# Altium schematic sheet MAZ000176 - Diagrama físico.SchDoc: MAZ000176 - Diagrama físico
size A; ApprovedBy: Christian Ledwidth; CheckedBy: Nahuel Martinez; Author: Santiago Marti; CompanyName: Body Health; DrawnBy: Santiago Marti; Revision: A; SheetNumber: 2; SheetTotal: 2
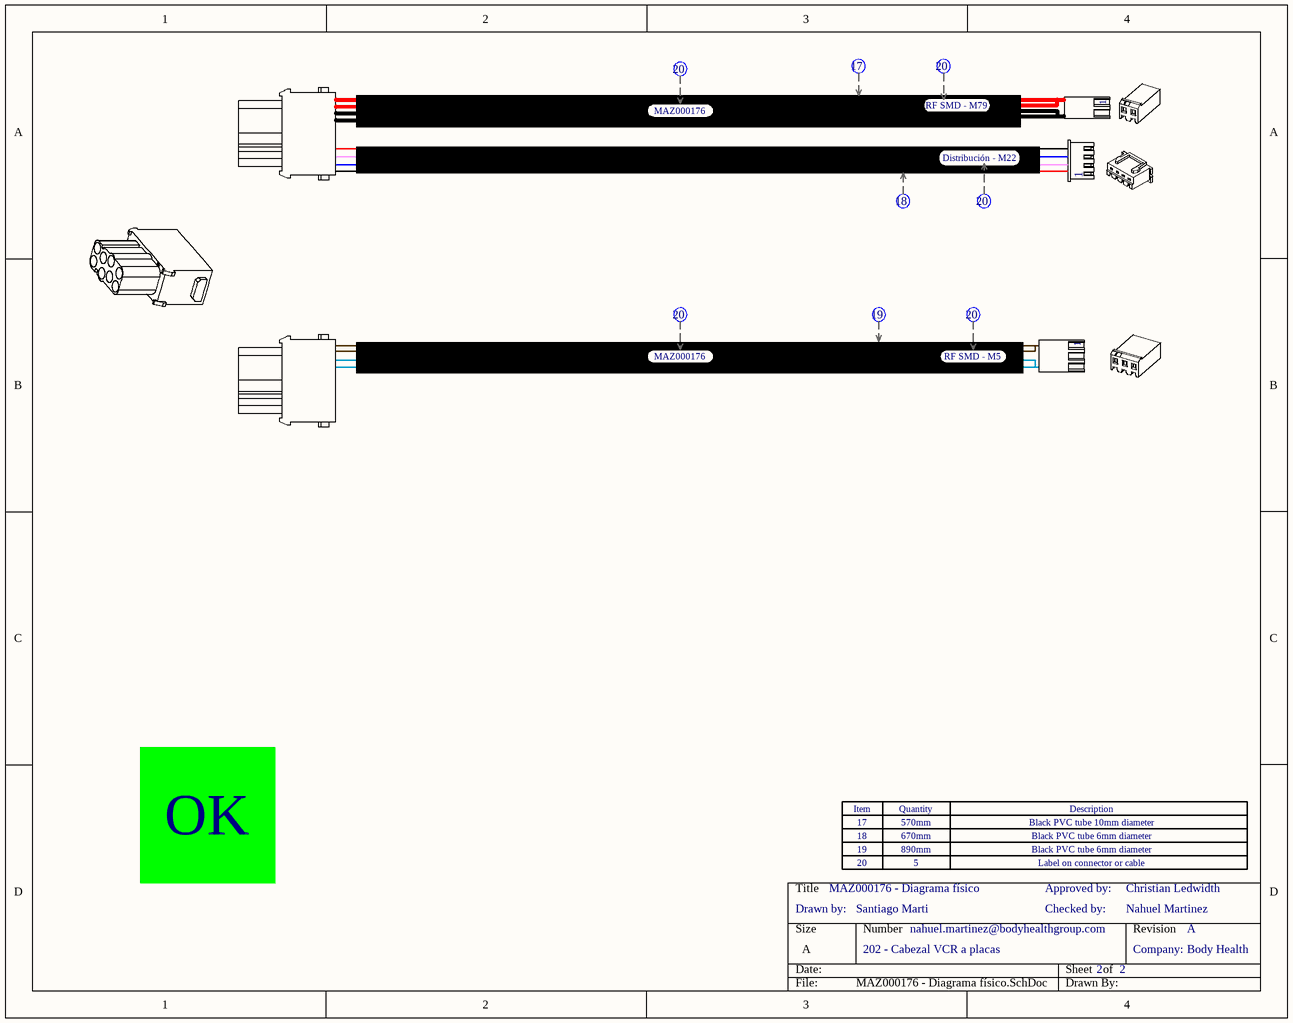
[diagram p0: MAZ000176 - Diagrama físico.SchDoc]

## Parts
(Parts that share a designator on the sheet are numbered #1, #2 ... from top to bottom, then left to right.)
Cab1  Cable  (value not drawn)
Cab2  Cable  (value not drawn)
Cab7  Cable  (value not drawn)
Cab8  Cable  (value not drawn)
Cab?#1  Cable  (value not drawn)
Cab?#2  Cable  (value not drawn)
Cab?#3  Cable  (value not drawn)
Cab?#4  Cable  (value not drawn)
Con1  XHP-4  (value not drawn)  (parts A,B of 4)
Con3  09140083101  (value not drawn)  (parts A,B of 4)
Con4  SL156-2  (value not drawn)  (parts A,B of 4)
Con6  09140083101  (value not drawn)  (part A of 4)
Con?#1  SL156-3  (value not drawn)  (part A of 4)
Con?#2  SL156-3  (value not drawn)  (part B of 4)
Zoc1  Zócalo_Header  (value not drawn)
Zoc?#1  Zócalo_Item  (value not drawn)
Zoc?#2  Zócalo_Item  (value not drawn)
Zoc?#3  Zócalo_Item  (value not drawn)
Zoc?#4  Zócalo_Item  (value not drawn)

## Notes on the sheet
- (near Cab?#3) RF SMD - M79
- (near Cab?#1) MAZ000176
- Distribución - M22
- (near Cab?#4) MAZ000176
- RF SMD - M5
- OK
- 17
- (near Zoc?#1) 18
- 570mm
- 670mm
- Black PVC tube 10mm diameter
- Black PVC tube 6mm diameter
- (near Zoc?#4) Drawn by:
- (near Zoc?#2) 19
- (near Zoc?#3) 20
- 890mm
- 5
- Checked by:
- Approved by:
- Label on connector or cable
- 202 - Cabezal VCR a placas
- nahuel.martinez@bodyhealthgroup.com
- Company:
- (in symbol Zócalo_Header) Item; Quantity; Description

## Library data of the parts
Cab1 = Cable: CallOut: 18; Largo: *mm; Sección: *mm2; Color: *
Cab2 Cab8 Cab?#1 Cab?#3 Cab?#4 = Cable: CallOut: 20; Largo: *mm; Sección: *mm2; Color: *
Cab7 = Cable: CallOut: 19; Largo: *mm; Sección: *mm2; Color: *
Cab?#2 = Cable: CallOut: 17; Largo: *mm; Sección: *mm2; Color: *
Con1 = XHP-4: CONN HOUSING 2.5MM 4POS; Fabricante: JST Sales America Inc.; Cod.DigiKey: 455-2267-ND; Cod.Fabricante: XHP-4; ComponentLink1Description: Manufacturer Link; ComponentLink1URL: http://www.jst-mfg.com/product/pdf/eng/eXH.pdf; DIGIKEYx50: 0.06220; CallOut: *; DIGIKEYx100: NO
Con3 Con6 = 09140083101: Han E Female 8 way; Fabricante: HARTING; Cod.DigiKey: 1195-1527-ND; Cod.Fabricante: 09140083101; ComponentLink1Description: Manufacturer Link; ComponentLink1URL: https://b2b.harting.com/files/download/PRD/PDF_TS/09140083101_100121409DRW009A.pdf; DIGIKEYx50: 7.60000; CallOut: *; DIGIKEYx100: 7.40000
Con4 = SL156-2: CONN RECEPT 2 POS W/RAMP SL-156; Cod.Fabricante: 640250-2; Fabricante: TE Connectivity AMP Connectors; Cod.DigiKey: A19950-ND; ComponentLink1Description: Manufacturer Link; ComponentLink1URL: https://www.te.com/commerce/DocumentDelivery/DDEController?Action=srchrtrv&DocNm=640250&DocType=Customer+Drawing&DocLang=English; DIGIKEYx50: 0.11420; CallOut: *; DIGIKEYx100: NO
Con?#1 Con?#2 = SL156-3: CONN RECEPT 3 POS W/RAMP SL-156; Cod.Fabricante: 640250-3; Fabricante: TE Connectivity AMP Connectors; Cod.DigiKey: A19951-ND; ComponentLink1Description: Manufacturer Link; ComponentLink1URL: https://www.te.com/commerce/DocumentDelivery/DDEController?Action=srchrtrv&DocNm=640250&DocType=Customer+Drawing&DocLang=English; DIGIKEYx50: 0.14460; CallOut: *; DIGIKEYx100: 0.13430
Zoc1 = Zócalo_Header: Header para el zócalo de referencias
Zoc?#1-Zoc?#4 = Zócalo_Item: Ítem para el zócalo de referencias; Desginator: *; Quantity: *; ItemDescription: *